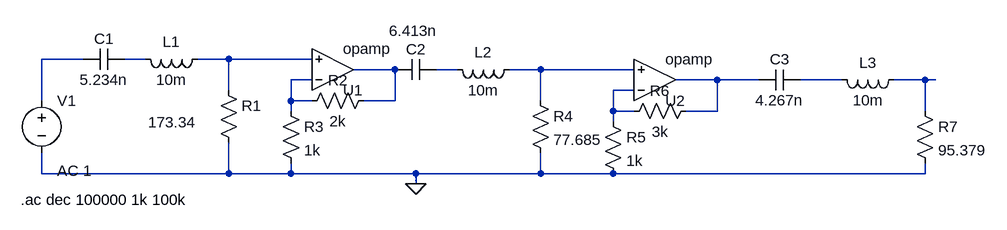
[diagram p0: schematic Bonus1.asc]
Bonus1.asc, the LTspice schematic file:
Version 4.1
SHEET 1 1352 680
WIRE -48 96 -112 96
WIRE 48 96 16 96
WIRE 176 96 128 96
WIRE 304 96 176 96
WIRE 432 112 368 112
WIRE 528 112 496 112
WIRE 656 112 608 112
WIRE 800 112 656 112
WIRE 304 128 272 128
WIRE 928 128 864 128
WIRE 992 128 928 128
WIRE 1120 128 1056 128
WIRE 1248 128 1200 128
WIRE 1264 128 1248 128
WIRE 176 144 176 96
WIRE 800 144 768 144
WIRE -112 160 -112 96
WIRE 272 160 272 128
WIRE 304 160 272 160
WIRE 432 160 432 112
WIRE 432 160 384 160
WIRE 656 160 656 112
WIRE 272 176 272 160
WIRE 768 176 768 144
WIRE 800 176 768 176
WIRE 928 176 928 128
WIRE 928 176 880 176
WIRE 1248 176 1248 128
WIRE 768 192 768 176
WIRE -112 272 -112 240
WIRE 176 272 176 224
WIRE 176 272 -112 272
WIRE 272 272 272 256
WIRE 272 272 176 272
WIRE 464 272 272 272
WIRE 656 272 656 240
WIRE 656 272 464 272
WIRE 768 272 656 272
WIRE 1248 272 1248 256
WIRE 1248 272 768 272
WIRE 464 288 464 272
FLAG 464 288 0
SYMBOL cap 16 80 R90
WINDOW 0 0 32 VBottom 2
WINDOW 3 32 32 VTop 2
SYMATTR InstName C1
SYMATTR Value 5.234n
SYMBOL ind 144 80 R90
WINDOW 0 5 56 VBottom 2
WINDOW 3 32 56 VTop 2
SYMATTR InstName L1
SYMATTR Value 10m
SYMATTR SpiceLine Rser=0
SYMBOL res 160 128 R0
WINDOW 3 -108 65 Left 2
SYMATTR InstName R1
SYMATTR Value 173.34
SYMBOL cap 496 96 R90
WINDOW 0 0 32 VBottom 2
WINDOW 3 -59 36 VTop 2
SYMATTR InstName C2
SYMATTR Value 6.413n
SYMBOL ind 624 96 R90
WINDOW 0 5 56 VBottom 2
WINDOW 3 32 56 VTop 2
SYMATTR InstName L2
SYMATTR Value 10m
SYMATTR SpiceLine Rser=0
SYMBOL res 640 144 R0
SYMATTR InstName R4
SYMATTR Value 77.685
SYMBOL opamp 832 192 M180
SYMATTR InstName U2
SYMBOL ind 1216 112 R90
WINDOW 0 5 56 VBottom 2
WINDOW 3 32 56 VTop 2
SYMATTR InstName L3
SYMATTR Value 10m
SYMATTR SpiceLine Rser=0
SYMBOL res 1232 160 R0
SYMATTR InstName R7
SYMATTR Value 95.379
SYMBOL cap 1056 112 R90
WINDOW 0 0 32 VBottom 2
WINDOW 3 32 32 VTop 2
SYMATTR InstName C3
SYMATTR Value 4.267n
SYMBOL voltage -112 144 R0
WINDOW 123 24 124 Left 2
WINDOW 39 0 0 Left 0
SYMATTR Value2 AC 1
SYMATTR InstName V1
SYMATTR Value ""
SYMBOL res 752 176 R0
SYMATTR InstName R5
SYMATTR Value 1k
SYMBOL res 896 160 R90
WINDOW 0 0 56 VBottom 2
WINDOW 3 32 56 VTop 2
SYMATTR InstName R6
SYMATTR Value 3k
SYMBOL opamp 336 176 M180
SYMATTR InstName U1
SYMBOL res 400 144 R90
WINDOW 0 0 56 VBottom 2
WINDOW 3 32 56 VTop 2
SYMATTR InstName R2
SYMATTR Value 2k
SYMBOL res 256 160 R0
SYMATTR InstName R3
SYMATTR Value 1k
TEXT -144 312 Left 2 !.ac dec 100000 1k 100k

The netlist it stands for:
* Bonus1.asc
C1 N002 N001 5.234n
L1 N003 N002 10m Rser=0
R1 N003 0 173.34
C2 N005 N004 6.413n
L2 N006 N005 10m Rser=0
R4 N006 0 77.685
X§U2 N011 N006 N008 opamp Aol=100K GBW=10Meg  ; pins invin noninvin out
L3 N010 N009 10m Rser=0
R7 N010 0 95.379
C3 N009 N008 4.267n
V1 N001 0 AC 1
R5 N011 0 1k
R6 N008 N011 3k
X§U1 N007 N003 N004 opamp Aol=100K GBW=10Meg  ; pins invin noninvin out
R2 N004 N007 2k
R3 N007 0 1k
.ac dec 100000 1k 100k
.backanno
.end